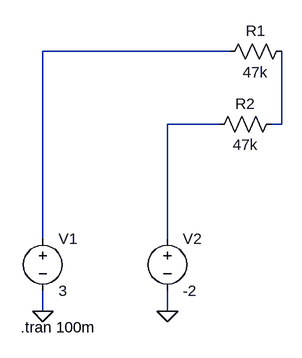
[diagram p0: schematic Draft1.asc]
Draft1.asc, the LTspice schematic file:
Version 4
SHEET 1 880 680
WIRE 352 -112 64 -112
WIRE 336 0 256 0
WIRE 432 0 432 -112
WIRE 432 0 416 0
WIRE 64 176 64 -112
WIRE 256 176 256 0
WIRE 64 288 64 256
WIRE 256 288 256 256
FLAG 64 288 0
FLAG 256 288 0
SYMBOL voltage 64 160 R0
SYMATTR InstName V1
SYMATTR Value 3
SYMBOL voltage 256 160 R0
SYMATTR InstName V2
SYMATTR Value -2
SYMBOL res 448 -128 R90
WINDOW 0 0 56 VBottom 2
WINDOW 3 32 56 VTop 2
SYMATTR InstName R1
SYMATTR Value 47k
SYMBOL res 432 -16 R90
WINDOW 0 0 56 VBottom 2
WINDOW 3 32 56 VTop 2
SYMATTR InstName R2
SYMATTR Value 47k
TEXT 30 312 Left 2 !.tran 100m

The netlist it stands for:
* Draft1.asc
V1 N001 0 3
V2 N002 0 -2
R1 N003 N001 47k
R2 N003 N002 47k
.tran 100m
.backanno
.end